# EAGLE design ardTriggerShield (EAGLE 6.6.0)
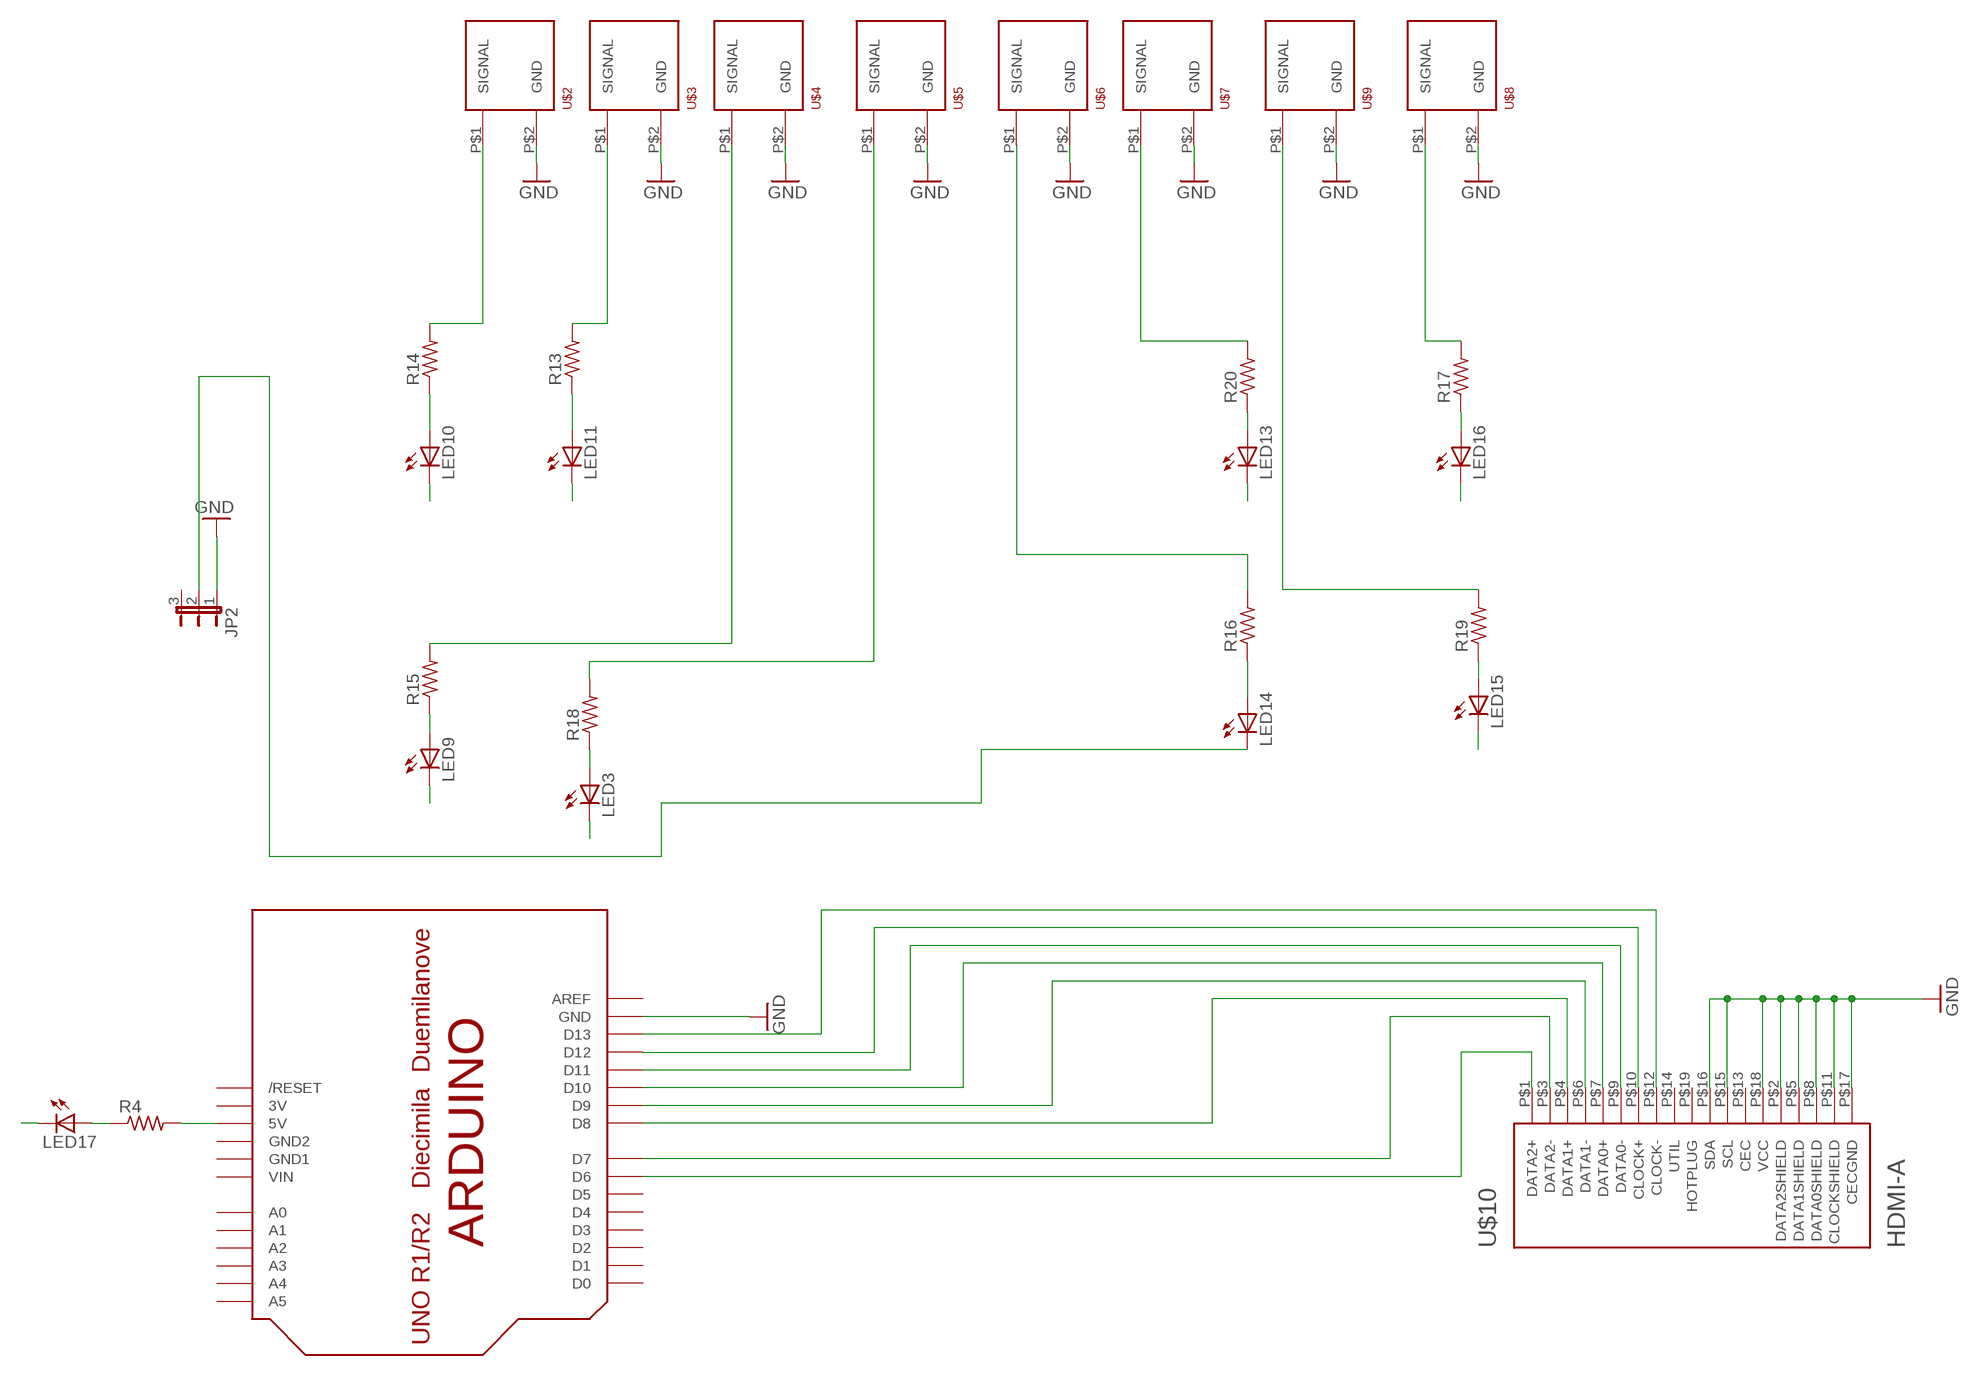
[diagram p0: schematic, sheet 1]

## Parts
JP2  JP2E  [JP2]
LED3  LEDCHIP-LED0805  [CHIP-LED0805]
LED9  LEDCHIP-LED0805  [CHIP-LED0805]
LED10  LEDCHIP-LED0805  [CHIP-LED0805]
LED11  LEDCHIP-LED0805  [CHIP-LED0805]
LED13  LEDCHIP-LED0805  [CHIP-LED0805]
LED14  LEDCHIP-LED0805  [CHIP-LED0805]
LED15  LEDCHIP-LED0805  [CHIP-LED0805]
LED16  LEDCHIP-LED0805  [CHIP-LED0805]
LED17  LEDCHIP-LED0805  [CHIP-LED0805]
R4  R_0603  [0603]
R13  R_0603  [0603]
R14  R_0603  [0603]
R15  R_0603  [0603]
R16  R_0603  [0603]
R17  R_0603  [0603]
R18  R_0603  [0603]
R19  R_0603  [0603]
R20  R_0603  [0603]
U$1  ARDUINO-NOHOLE  [ARDUINO-NOHOLE]
U$2  BNC_VERTICAL  [BNC_VERTICAL]
U$3  BNC_VERTICAL  [BNC_VERTICAL]
U$4  BNC_VERTICAL  [BNC_VERTICAL]
U$5  BNC_VERTICAL  [BNC_VERTICAL]
U$6  BNC_VERTICAL  [BNC_VERTICAL]
U$7  BNC_VERTICAL  [BNC_VERTICAL]
U$8  BNC_VERTICAL  [BNC_VERTICAL]
U$9  BNC_VERTICAL  [BNC_VERTICAL]
U$10  HDMI-A  [HDMI_A]

## Nets
D6: R17.2 U$1.D6 U$8.P$1(SIGNAL) U$10.P$1(DATA2+)
D7: R19.2 U$1.D7 U$9.P$1(SIGNAL) U$10.P$3(DATA2-)
D8: R20.2 U$1.D8 U$7.P$1(SIGNAL) U$10.P$4(DATA1+)
D9: R16.2 U$1.D9 U$6.P$1(SIGNAL) U$10.P$6(DATA1-)
D10: R18.2 U$1.D10 U$5.P$1(SIGNAL) U$10.P$7(DATA0+)
D11: R15.2 U$1.D11 U$4.P$1(SIGNAL) U$10.P$9(DATA0-)
D12: R13.2 U$1.D12 U$3.P$1(SIGNAL) U$10.P$10(CLOCK+)
D13: R14.2 U$1.D13 U$2.P$1(SIGNAL) U$10.P$12(CLOCK-)
GND: JP2.1 U$1.GND U$2.P$2(GND) U$3.P$2(GND) U$4.P$2(GND) U$5.P$2(GND) U$6.P$2(GND) U$7.P$2(GND) U$8.P$2(GND) U$9.P$2(GND) U$10.P$2(DATA2SHIELD) U$10.P$5(DATA1SHIELD) U$10.P$8(DATA0SHIELD) U$10.P$11(CLOCKSHIELD) U$10.P$15(SCL) U$10.P$16(SDA) U$10.P$17(CECGND) U$10.P$18(VCC)
LED: JP2.2 LED3.C LED9.C LED10.C LED11.C LED13.C LED14.C LED15.C LED16.C LED17.C
N$2: R4.2 U$1.5V
N$3: LED17.A R4.1
N$10: LED10.A R14.1
N$11: LED11.A R13.1
N$12: LED9.A R15.1
N$13: LED3.A R18.1
N$14: LED14.A R16.1
N$15: LED15.A R19.1
N$16: LED13.A R20.1
N$17: LED16.A R17.1
Unconnected: JP2.3 U$1.A0 U$1.A1 U$1.A2 U$1.A3 U$1.A4 U$1.A5 U$1.AREF U$1.D0 U$1.D1 U$1.D2 U$1.D3 U$1.D4 U$1.D5 U$1.RESET(/RESET) U$10.P$13(CEC) U$10.P$14(UTIL) U$10.P$19(HOTPLUG)

## Power pins joined to a net without a drawn wire
3V: U$1.3V
GND1: U$1.GND1
GND2: U$1.GND2
VIN: U$1.VIN

## Library data of the parts
JP2 = jumper:JP2E: JUMPER
LED3 LED9-LED11 LED13-LED17 = led:LED: LED OSRAM: - CHIPLED LG R971, LG N971, LY N971, LG Q971, LY Q971, LO R971, LY R971 LH N974, LH R974 LS Q976, LO Q976, LY Q976 LO Q996 - Hyper CHIPLED LW Q18S LB Q993, LB Q99A, LB R99A - SideLED LS A670, LO A670, LY A670, LG A670, LP A670 LB A673, LV A673, LT A673, LW A673 LH A674 LY A675 LS A676, LA A676, LO A676, LY A676, LW A676 LS A679, LY A679, LG A679 - Hyper Micro SIDELED® LS Y876, LA Y876, LO Y876, LY Y876 LT Y87S - SmartLED LW L88C, LW L88S LB L89C, LB L89S, LG L890 LS L89K, LO L89K, LY L89K LS L896, LA L896, LO L896, LY L896 - TOPLED LS T670, LO T670, LY T670, LG T670, LP T670 LSG T670, LSP T670, LSY T670, LOP T670, LYG T670 LG T671, LOG T671, LSG T671 LB T673, LV T673, LT T673, LW T673 LH T674 LS T676, LA T676, LO T676, LY T676, LB T676, LH T676, LSB T676, LW T676 LB T67C, LV T67C, LT T67C, LS T67K, LO T67K, LY T67K, LW E67C LS E67B, LA E67B, LO E67B, LY E67B, LB E67C, LV E67C, LT E67C LW T67C LS T679, LY T679, LG T679 LS T770, LO T770, LY T770, LG T770, LP T770 LB T773, LV T773, LT T773, LW T773 LH T774 LS E675, LA E675, LY E675, LS T675 LS T776, LA T776, LO T776, LY T776, LB T776 LHGB T686 LT T68C, LB T68C - Hyper Mini TOPLED® LB M676 - Mini TOPLED Santana® LG M470 LS M47K, LO M47K, LY M47K Source: http://www.osram.convergy.de LUXEON: - LUMILED® LXK2-PW12-R00, LXK2-PW12-S00, LXK2-PW14-U00, LXK2-PW14-V00 LXK2-PM12-R00, LXK2-PM12-S00, LXK2-PM14-U00 LXK2-PE12-Q00, LXK2-PE12-R00, LXK2-PE12-S00, LXK2-PE14-T00, LXK2-PE14-U00 LXK2-PB12-K00, LXK2-PB12-L00, LXK2-PB12-M00, LXK2-PB14-N00, LXK2-PB14-P00, LXK2-PB14-Q00 LXK2-PR12-L00, LXK2-PR12-M00, LXK2-PR14-Q00, LXK2-PR14-R00 LXK2-PD12-Q00, LXK2-PD12-R00, LXK2-PD12-S00 LXK2-PH12-R00, LXK2-PH12-S00 LXK2-PL12-P00, LXK2-PL12-Q00, LXK2-PL12-R00 Source: www.luxeon.com KINGBRIGHT: KA-3528ASYC Source: www.kingbright.com
R4 R13-R20 = RHD2000_eval_board:R: Resistor
U$1 = ARDUINO_nohole:ARDUINO: Arduino Diecimila/Duemilanove Make a shield with ease, this package has all the named pins as well as the two mounting drill holes and an outline of the USB and DC power connector. The outline is on the DIMENSION layer, so if your board house uses it they will cut the outline to match. http://www.ladyada.net/library/pcb/eaglelibrary.html
U$2-U$9 = open-ephys:BNC_VERTICAL: BNC plug, through-hole, vertical
U$10 = connectors:HDMI-A: Horizonal HDMI type "A" jack

## Board
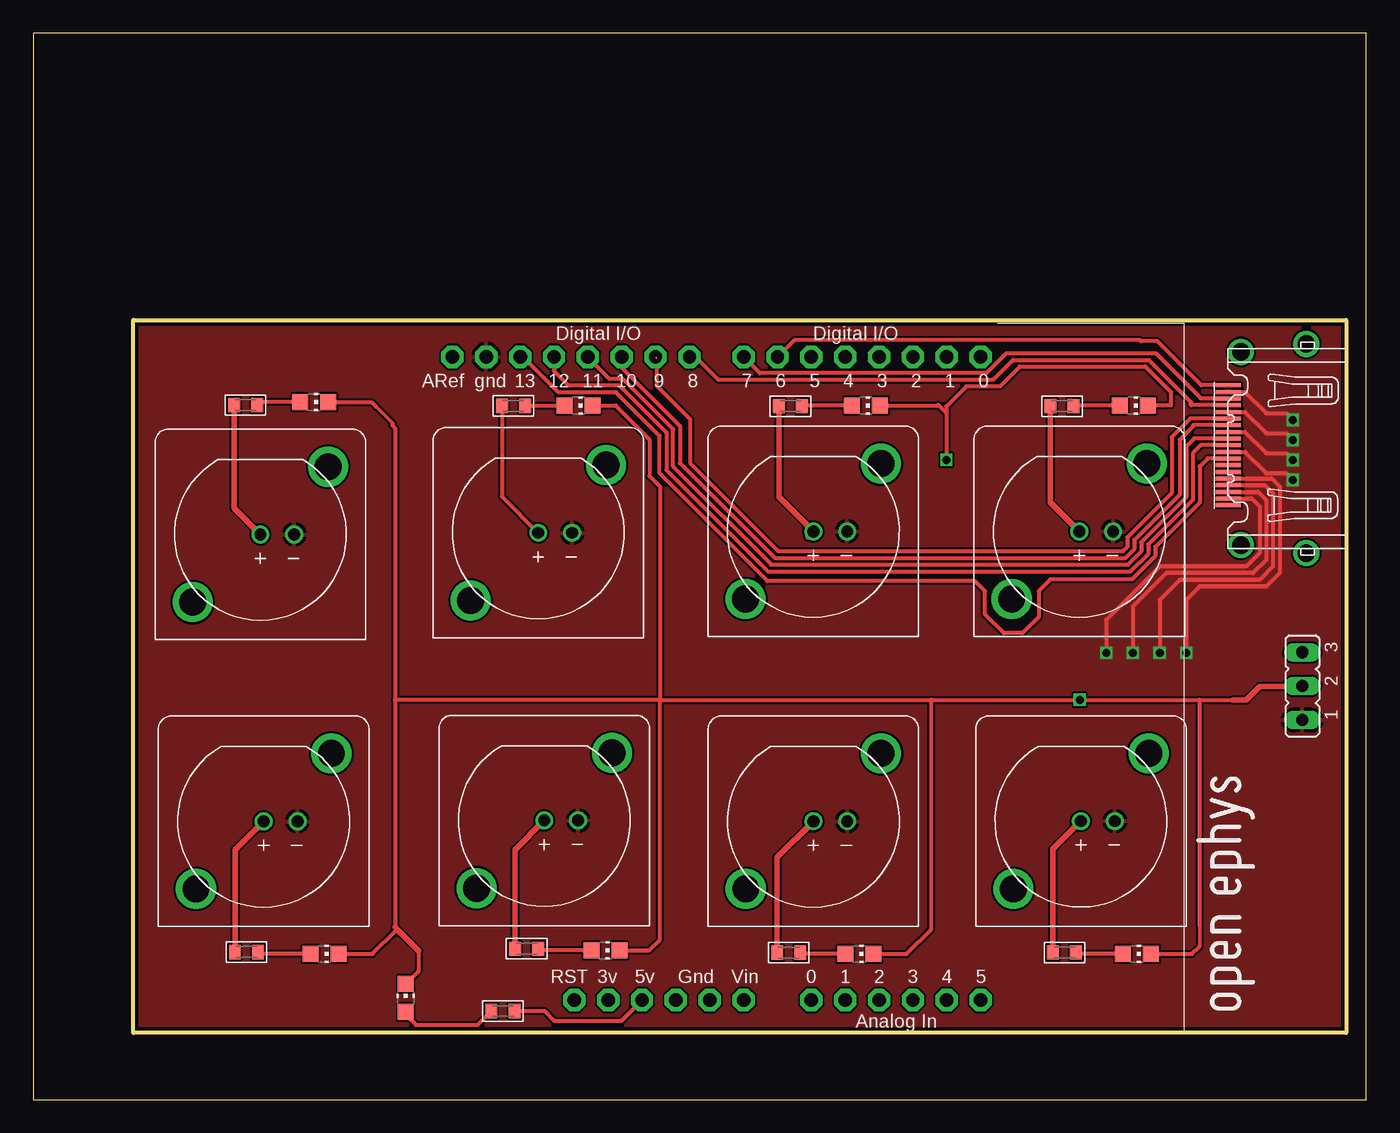
[diagram p1: board, top side]
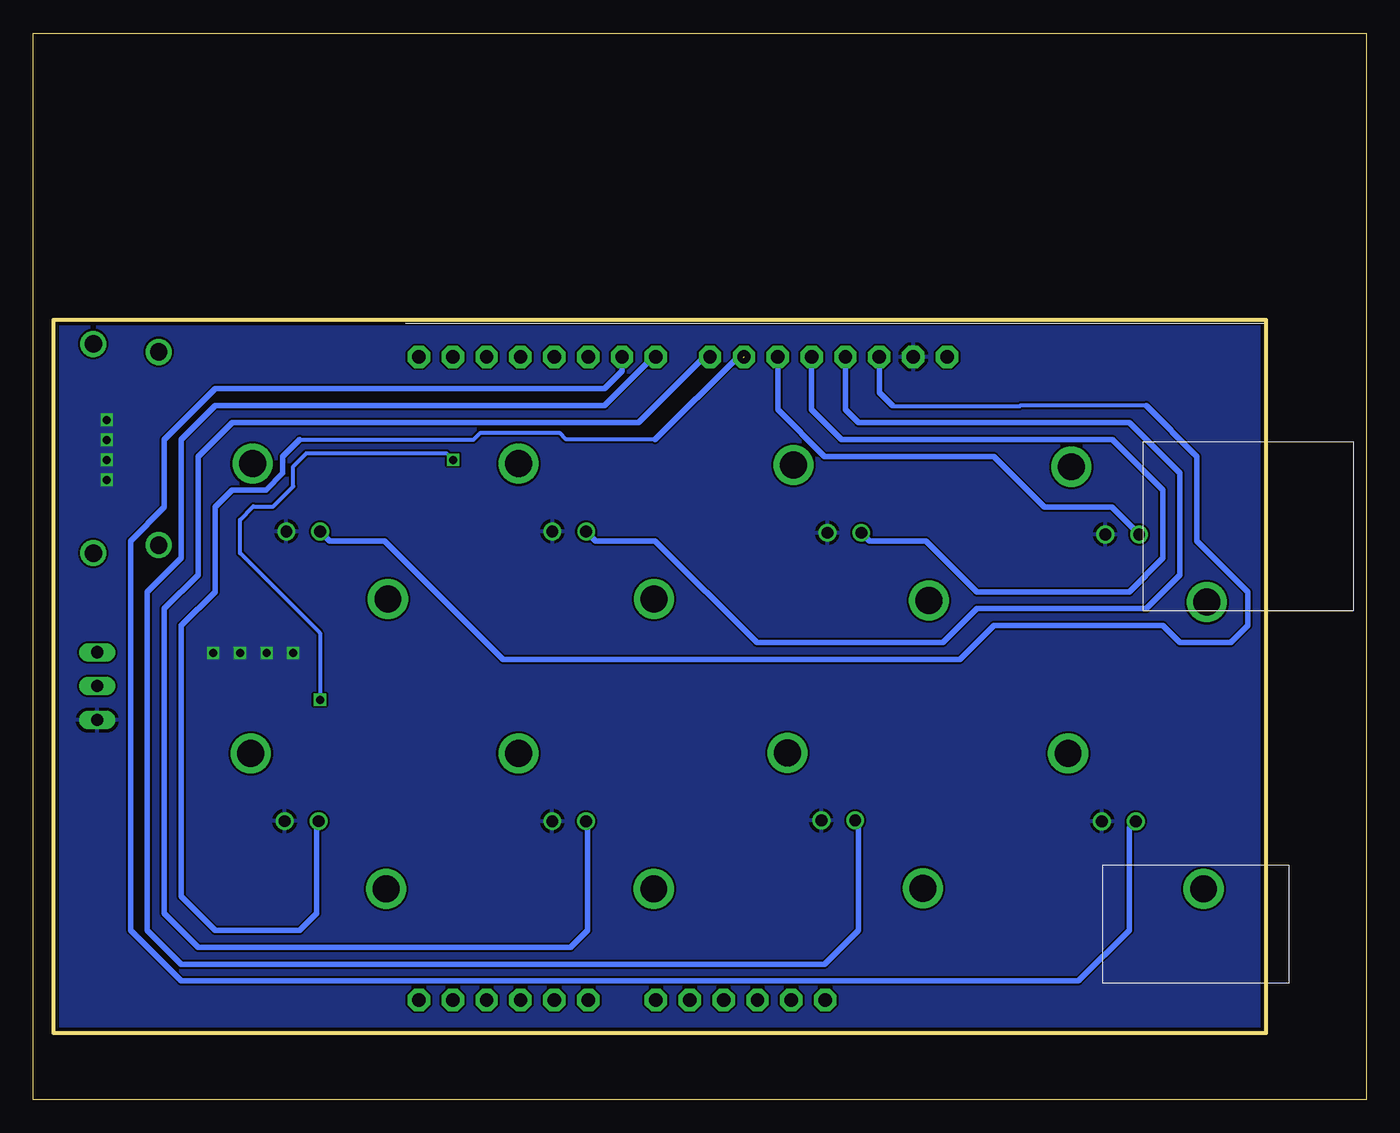
[diagram p2: board, bottom side, seen from below]

Size 100 x 80 mm. Coordinates in mm from the lower left corner, seen from the top.
Outline: 0,0 100,0 100,80 0,80 0,0
Outline: 7.5,58.5 98.5,58.5 98.5,5 7.5,5 7.5,58.5
Copper layers (1*16): Top 0.035mm / dielectric 0.2mm / Bottom 0.035mm
Design rules "SeeedStudio_DRU_no_angle_20130527 2 *": minimum track width 6mil, minimum drill 12mil, track to track 6mil, track to pad 6mil, pad to pad 6mil, via to via 6mil, smd to smd 0mil, copper to edge 10mil, drill to drill 10mil, minimum pad ring 6mil, minimum via ring 6mil, stop-mask expansion 2mil, vias tented up to drill 25mil, thermal gap 10mil

### Footprints (pad centres in the part's own frame; a part is rotated, then mirrored left to right if it is on the bottom)
JP2 = drill 0.914 long: 1 -2.54,0; 2 0,0; 3 2.54,0
CHIP-LED0805 = smd 1.2 x 1.2: A 0,-1.05; C 0,1.05
0603 = smd 0.889 x 1.067: 1 -0.864,0; 2 0.864,0
ARDUINO-NOHOLE = drill 1 pad 1.676 octagon: 3V 35.56,2.54; 5V 38.1,2.54; A0 50.8,2.54; A1 53.34,2.54; A2 55.88,2.54; A3 58.42,2.54; A4 60.96,2.54; A5 63.5,2.54; AREF 23.876,50.8; D0 63.5,50.8; D1 60.96,50.8; D2 58.42,50.8; D3 55.88,50.8; D4 53.34,50.8; D5 50.8,50.8; D6 48.26,50.8; D7 45.72,50.8; D8 41.656,50.8; D9 39.116,50.8; D10 36.576,50.8; D11 34.036,50.8; D12 31.496,50.8; D13 28.956,50.8; GND 26.416,50.8; GND1 43.18,2.54; GND2 40.64,2.54; RESET 33.02,2.54; VIN 45.72,2.54
BNC_VERTICAL = drill 0.89: P$1 0,0; P$2 2.54,0 | drill 2.01: P$3 5.08,5.08; P$4 -5.08,-5.08
HDMI_A = smd 0.3 x 1.9: P$1 4.75,3.95; P$2 4.25,3.95; P$3 3.75,3.95; P$4 3.25,3.95; P$5 2.75,3.95; P$6 2.25,3.95; P$7 1.75,3.95; P$8 1.25,3.95; P$9 0.75,3.95; P$10 0.25,3.95; P$11 -0.25,3.95; P$12 -0.75,3.95; P$13 -1.25,3.95; P$14 -1.75,3.95; P$15 -2.25,3.95; P$16 -2.75,3.95; P$17 -3.25,3.95; P$18 -3.75,3.95; P$19 -4.25,3.95 | drill 1.3: P$20 -7.25,3; P$21 7.25,3; P$22 7.85,-1.9; P$23 -7.85,-1.9

### Placement (x,y rotation side)
JP2  95.2,31.02 90 top
LED3  21.08,52.32 270 top
LED9  40.89,52.07 270 top
LED10  82.55,52.07 270 top
LED11  62.48,52.07 270 top
LED13  61.98,10.92 270 top
LED14  82.8,10.92 270 top
LED15  42.93,11.18 270 top
LED16  21.84,10.92 270 top
LED17  27.94,7.62 0 top
R4  35.23,6.64 0 top
R13  56.81,52.02 180 top
R14  77.18,52.02 180 top
R15  36.02,52.04 180 top
R16  77.37,11.04 180 top
R17  15.99,11.07 180 top
R18  15.92,52.1 180 top
R19  37.01,11.31 180 top
R20  56.67,11.02 180 top
U$1  7.57,4.92 0 top
U$2  78.47,42.63 0 top
U$3  58.52,42.63 0 top
U$4  37.88,42.52 0 top
U$5  17.04,42.4 0 top
U$6  78.6,20.89 0 top
U$7  58.52,20.88 0 top
U$8  17.28,20.88 0 top
U$9  38.33,20.93 0 top
U$10  93.6,48.85 90 top
U$11  [OPEN_EPHYS_LOGO]  92.11,6.05 90 top

### Tracks (layer width: path | path; a pad name or v marks a point on that pad's centre or on a via)
D6
  Top 0.305: U$10.P$1 87.62,53.6 84.33,56.9 83.1,56.9 83,57 57.11,57 U$1.D6
  Top 0.406: R17.2 15.13,18.72 U$8.P$1
  Bottom 0.406: U$1.D6 55.83,54.66 57.15,53.34 86.36,53.34 90.17,49.53 90.17,44.45 92.71,41.91 92.71,12.7 88.9,8.89 21.59,8.89 17.78,12.7 17.78,20.38 U$8.P$1
D7
  Top 0.305: U$10.P$3 87.58,52.6 87.58,52.63 84.21,56 73,56 71.5,54.5 54.51,54.5 U$1.D7
  Top 0.406: R19.2 36.14,18.75 U$9.P$1
  Bottom 0.406: U$1.D7 53.5,55.72 57.15,52.07 86.36,52.07 88.9,49.53 88.9,40.64 91.44,38.1 91.44,12.7 88.9,10.16 40.64,10.16 38.1,12.7 38.1,20.7 U$9.P$1
D8
  Top 0.305: U$10.P$4 86.85,52.1 86.85,52.34 83.69,55.5 73.5,55.5 72,54 51.41,54 49.95,55.45 49.49,55.45 U$1.D8
  Top 0.406: R20.2 55.81,18.17 U$7.P$1
  Bottom 0.406: U$1.D8 49.69,55.72 54.61,50.8 85.09,50.8 87.63,48.26 87.63,39.37 90.17,36.83 90.17,13.97 87.63,11.43 59.69,11.43 58.42,12.7 58.42,20.78 U$7.P$1
D9  (1 unrouted)
  Top 0.305: U$10.P$6 86.8,51.1 85.4,49.7 85.4,45.5 82.08,42.17 82.08,41.48 81.75,41.15 55.88,41.15 49.28,47.75 49.28,51.05 46.77,53.56 46.77,55.63
  Top 0.406: R16.2 76.5,18.79 U$6.P$1
  Bottom 0.305: 53.34,49.53 60.03,49.53 60.5,50 66.5,50 67,49.5 80.04,49.5 80.27,49.27
  Bottom 0.406: U$1.D9 47.15,55.72 53.34,49.53 | 80.01,49.53 80.27,49.27 81.28,48.26 81.28,46.99 82.55,45.72 85.09,45.72 86.36,44.45 86.36,38.1 88.9,35.56 88.9,15.24 86.36,12.7 80.01,12.7 78.74,13.97 78.74,20.75 U$6.P$1
D10
  Top 0.305: U$10.P$7 87,50.6 87,50.5 86,49.5 86,45.4 82.6,42 82.6,41.3 81.94,40.64 55.63,40.64 48.51,47.75 48.51,50.55 44.15,54.91 U$1.D10
  Top 0.406: R18.2 15.06,44.38 U$5.P$1
  Bottom 0.406: U$1.D10 44.15,51.77 40.64,48.26 27.94,48.26 24.13,44.45 19.08,44.45 U$5.P$1
D11
  Top 0.305: U$10.P$9 87.1,49.6 86.5,49 86.5,45.2 83.12,41.83 83.12,41.12 82.13,40.13 55.37,40.13 48.01,47.5 48.01,50.29 44.2,54.1 43.18,54.1 41.61,55.68 U$1.D11 | R15.2 35.16,45.25 U$4.P$1
  Bottom 0.406: U$1.D11 41.61,51.77 39.37,49.53 19.05,49.53 15.24,45.72 15.24,40.64 17.78,38.1 29.21,38.1 33.02,41.91 37.27,41.91 U$4.P$1
D12
  Top 0.305: U$10.P$10 87.6,49.1 87,48.5 87,45 83.65,41.65 83.65,40.95 82.32,39.62 55.12,39.62 47.5,47.24 47.5,50.04 43.94,53.59 40.13,53.59 39.07,54.66 U$1.D12
  Top 0.406: 58.11,42.22 U$3.P$1 55.94,45.21 R13.2
  Bottom 0.406: U$1.D12 39.07,51.77 38.1,50.8 17.78,50.8 13.97,46.99 13.97,39.37 16.51,36.83 29.21,36.83 31.75,34.29 45.72,34.29 53.34,41.91 57.8,41.91 U$3.P$1
D13
  Top 0.305: U$10.P$12 88.1,48.1 87.5,47.5 87.5,44.8 84.17,41.48 84.17,40.77 82.42,39.02 76.3,39.02 75.42,38.15 75.42,36.23 74.2,35 72.8,35 71.4,36.4 71.4,38.15 70.65,38.9 55.08,38.9 46.99,46.99 46.99,49.78 43.69,53.09 39.37,53.09 36.74,55.72 U$1.D13
  Top 0.406: R14.2 76.31,44.79 U$2.P$1
  Bottom 0.305: 35.56,52.07 35.49,52 26,52 25.93,52.07 16.51,52.07
  Bottom 0.406: U$1.D13 36.53,53.04 35.56,52.07 | 16.51,52.07 12.7,48.26 12.7,41.91 8.89,38.1 8.89,35.56 10.16,34.29 13.97,34.29 15.24,35.56 27.94,35.56 30.48,33.02 64.77,33.02 73.66,41.91 77.75,41.91 U$2.P$1
GND  (via drill 0.6)
  Top 0.305: U$10.P$18 91.4,45.1 92,44.5 92,41 91,40 84.5,40 80.5,36 v80.5,33.5 | U$10.P$17 91.9,45.6 92.5,45 92.5,40.5 91.5,39.5 85,39.5 82.5,37 v82.5,33.5 | U$10.P$16 92.4,46.1 93,45.5 93,40 92,39 86,39 84.5,37.5 v84.5,33.5 | U$10.P$15 92.9,46.6 93.5,46 93.5,39.5 92.5,38.5 87.5,38.5 86.5,37.5 v86.5,33.5 | U$10.P$2 90.9,53.1 92.5,51.5 94,51.5 v94.5,51 | U$10.P$5 90.9,51.6 92.5,50 94,50 v94.5,49.5 | U$10.P$8 90.9,50.1 92.5,48.5 94,48.5 v94.5,48 | U$10.P$11 90.9,48.6 92.5,47 94,47 v94.5,46.5
  pour Bottom: 6,60 100,60 100,4 6,4
  pour Top: 6,60 100,60 100,4 6,4
LED  (via drill 0.6)
  Top 0.254: 25.71,51.99 26.95,50.75 | 87.5,11.5 87.5,13
  Top 0.305: 26.95,50.75 26.95,50.58 27.12,50.4 27.12,30 | 27.12,30 27.12,12.95 | 68.5,51.5 68.5,52 70,53.5 72.5,53.5 74,55 83.43,55 85.34,53.09 85.34,52.07 LED10.C | 68.5,51.5 v68.5,48 | 68.5,51.5 67.87,52.13 67.82,52.07 LED11.C | 47,30 27.12,30 | 47,30 47,46 46.23,46.77 46.23,49.53 43.69,52.07 LED9.C | 67.38,30 67.38,12.78 65.52,10.92 LED13.C | 47,30 47,12 46.18,11.18 LED15.C | 47,30 67.38,30 | 67.38,30 v78.5,30 87.5,30 | 87.5,13 87.5,30 | 87.5,30 90,30 | 27.29,12.79 25.42,10.92 LED16.C | LED3.C 25.38,52.32 25.71,51.99 | 28.9,11.18 28.9,9.63 LED17.C | LED14.C 86.92,10.92 87.5,11.5
  Top 0.406: 28.9,11.18 27.29,12.79 27.12,12.95 | 90,30 91,30 92,31 95.18,31 JP2.2
  Bottom 0.254: 69,48.5 v68.5,48
  Bottom 0.305: 69,48.5 79.5,48.5 80.5,47.5 80.5,46 82,44.5 83.5,44.5 84.5,43.5 84.5,41 78.5,35 v78.5,30
N$2
  Top 0.305: R4.2 38.35,6.64 39.07,5.92 44.13,5.92 U$1.5V
N$3
  Top 0.305: 34.23,6.78 R4.1 33.31,5.59 28.7,5.59 27.94,6.35 LED17.A
N$10
  Top 0.305: LED10.A 78.09,52.07 R14.1
N$11
  Top 0.254: 57.77,52.13 R13.1
  Top 0.305: LED11.A 57.72,52.07 R13.1
N$12
  Top 0.305: LED9.A 39.87,52.04 R15.1
N$13
  Top 0.254: 16.89,51.99 R18.1
  Top 0.305: LED3.A 17.01,52.32 R18.1
N$14
  Top 0.254: 78.25,11.02 R16.1
  Top 0.305: LED14.A 78.35,10.92 R16.1
N$15
  Top 0.254: 38.11,11.07 R19.1
  Top 0.305: LED15.A 38.01,11.18 R19.1
N$16
  Top 0.254: R20.1
  Top 0.305: LED13.A 57.63,10.92 R20.1
N$17
  Top 0.305: 16.89,11.03 R17.1 17,10.92 LED16.A

### Text on the board
tDocu: 5 | 7 | 8 | 6 | CH6 | CH7 | CH8 | CH5 | HDMI | LED / OFF | CH4 | CH1 | CH2 | CH3 | LED / ON | I/O Shield | 1 | 2 | 3 | 4 | ON | version 1.0, July 2014 / design at open-ephys.com